# EAGLE design shield (EAGLE 7.0.0)
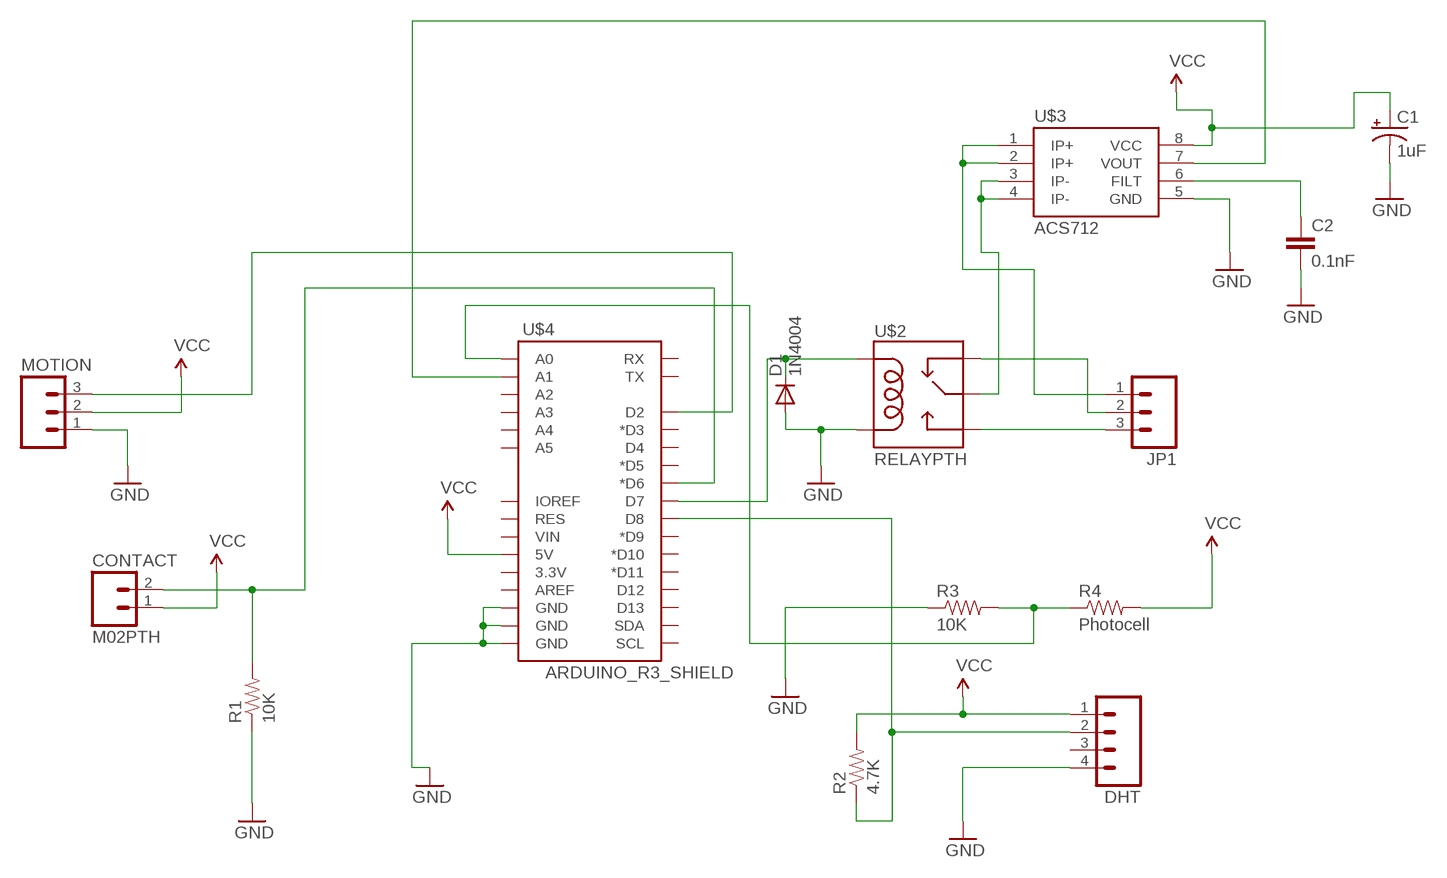
[diagram p0: schematic, sheet 1]

## Parts
C1  1uF  CAP_POLPTH2  [CPOL-RADIAL-10UF-25V]
C2  0.1nF  CAPPTH2  [CAP-PTH-SMALL2]
CONTACT  M02PTH  [1X02]
D1  1N4004  [DO41-10]
DHT  M04LOCK  [1X04_LOCK]
JP1  M03SCREW  [SCREWTERMINAL-3.5MM-3]
MOTION  M03PTH  [1X03]
R1  10K  RESISTORAXIAL-0.3  [AXIAL-0.3]
R2  4.7K  RESISTORAXIAL-0.3  [AXIAL-0.3]
R3  10K  RESISTORAXIAL-0.3  [AXIAL-0.3]
R4  Photocell  RESISTORAXIAL-0.3  [AXIAL-0.3]
U$2  RELAYPTH  [RELAY-G5Q]
U$3  ACS712  [SO08]
U$4  ARDUINO_R3_SHIELD  [UNO_R3_SHIELD]

## Nets
GND: C1.2(-) C2.2 D1.A DHT.4 MOTION.1 R1.P$1 R3.P$1 U$2.1(COIL2) U$3.5(GND) U$4.GND@0(GND) U$4.GND@1(GND) U$4.GND@2(GND)
N$1: R3.P$2 R4.P$1 U$4.A0
N$2: D1.C U$2.5(COIL1) U$4.D7
N$3: JP1.2 U$2.4(NC)
N$4: U$2.2(MAIN) U$3.3(IP-) U$3.4(IP-)
N$5: JP1.3 U$2.3(NO)
N$6: JP1.1 U$3.1(IP+) U$3.2(IP+)
N$7: C2.1 U$3.6(FILT)
N$8: MOTION.3 U$4.D2
N$9: DHT.2 R2.P$1 U$4.D8
N$10: CONTACT.2 R1.P$2 U$4.D6(*D6)
N$19: U$3.7(VOUT) U$4.A1
VCC: C1.1(+) CONTACT.1 DHT.1 MOTION.2 R2.P$2 R4.P$2 U$3.8(VCC) U$4.5V
Unconnected: DHT.3 U$4.3.3V U$4.A2 U$4.A3 U$4.A4 U$4.A5 U$4.AREF U$4.D3(*D3) U$4.D4 U$4.D5(*D5) U$4.D9(*D9) U$4.D10(*D10) U$4.D11(*D11) U$4.D12 U$4.D13 U$4.IOREF U$4.RES U$4.RX U$4.SCL U$4.SDA U$4.TX U$4.VIN

## Library data of the parts
C1 = SparkFun-Passives:CAP_POL: Capacitor Polarized These are standard SMD and PTH capacitors. Normally 10uF, 47uF, and 100uF in electrolytic and tantalum varieties. Always verify the external diameter of the through hole cap, it varies with capacity, voltage, and manufacturer. The EIA devices should be standard.
C2 = SparkFun-Passives:CAP: Capacitor Standard 0603 ceramic capacitor, and 0.1" leaded capacitor.
CONTACT = SparkFun-Connectors:M02: Standard 2-pin 0.1" header. Use with - straight break away headers ( PRT-00116) - right angle break away headers (PRT-00553) - swiss pins (PRT-00743) - machine pins (PRT-00117) - female headers (PRT-00115) Molex polarized connector foot print use with: PRT-08233 with associated crimp pins and housings. 2.54_SCREWTERM for use with PRT-10571. 3.5mm Screw Terminal footprints for PRT-08084 5mm Screw Terminal footprints for use with PRT-08433
D1 = adafruit:1N4004: DIODE General purpose 1N400x type rectifier (With bigger pads) http://www.ladyada.net/library/pcb/eaglelibrary.html
DHT = SparkFun-Connectors:M04: Header 4 Standard 4-pin 0.1" header. Use with straight break away headers (SKU : PRT-00116), right angle break away headers (PRT-00553), swiss pins (PRT-00743), machine pins (PRT-00117), and female headers (PRT-00115). Molex polarized connector foot print use with SKU : PRT-08231 with associated crimp pins and housings. 1MM SMD Version SKU: PRT-10208
JP1 MOTION = SparkFun-Connectors:M03: Header 3 Standard 3-pin 0.1" header. Use with straight break away headers (SKU : PRT-00116), right angle break away headers (PRT-00553), swiss pins (PRT-00743), machine pins (PRT-00117), and female headers (PRT-00115). Molex polarized connector foot print use with SKU : PRT-08232 with associated crimp pins and housings.
R1-R4 = SparkFun-Passives:RESISTOR: Resistor Basic schematic elements and footprints for 0603, 1206, and PTH resistors.
U$2 = SparkFun-Electromechanical:RELAY: SPDT relay (COM-00101)
U$3 = SparkFun-AnalogIC:ACS712: Hall-effect-based isolated linear current sensor
U$4 = SparkFun-Boards:ARDUINO_R3_SHIELD: Shield form compatible with the Arduino Uno R3.

## Board
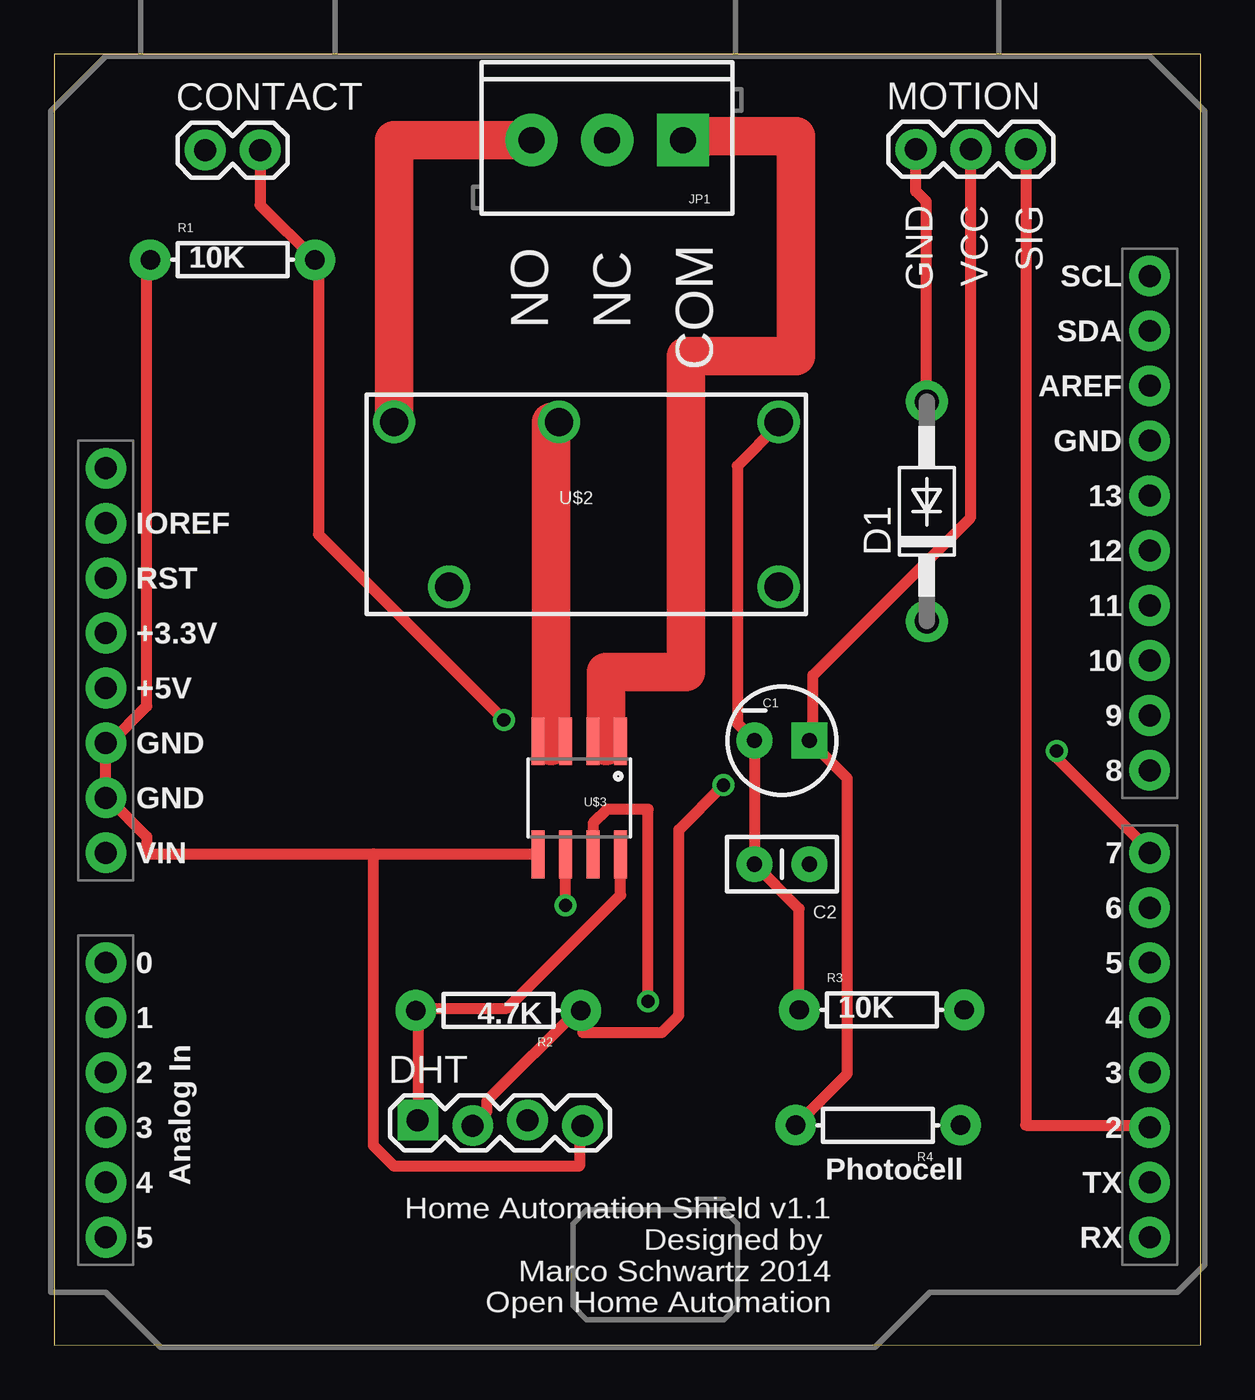
[diagram p1: board, top side]
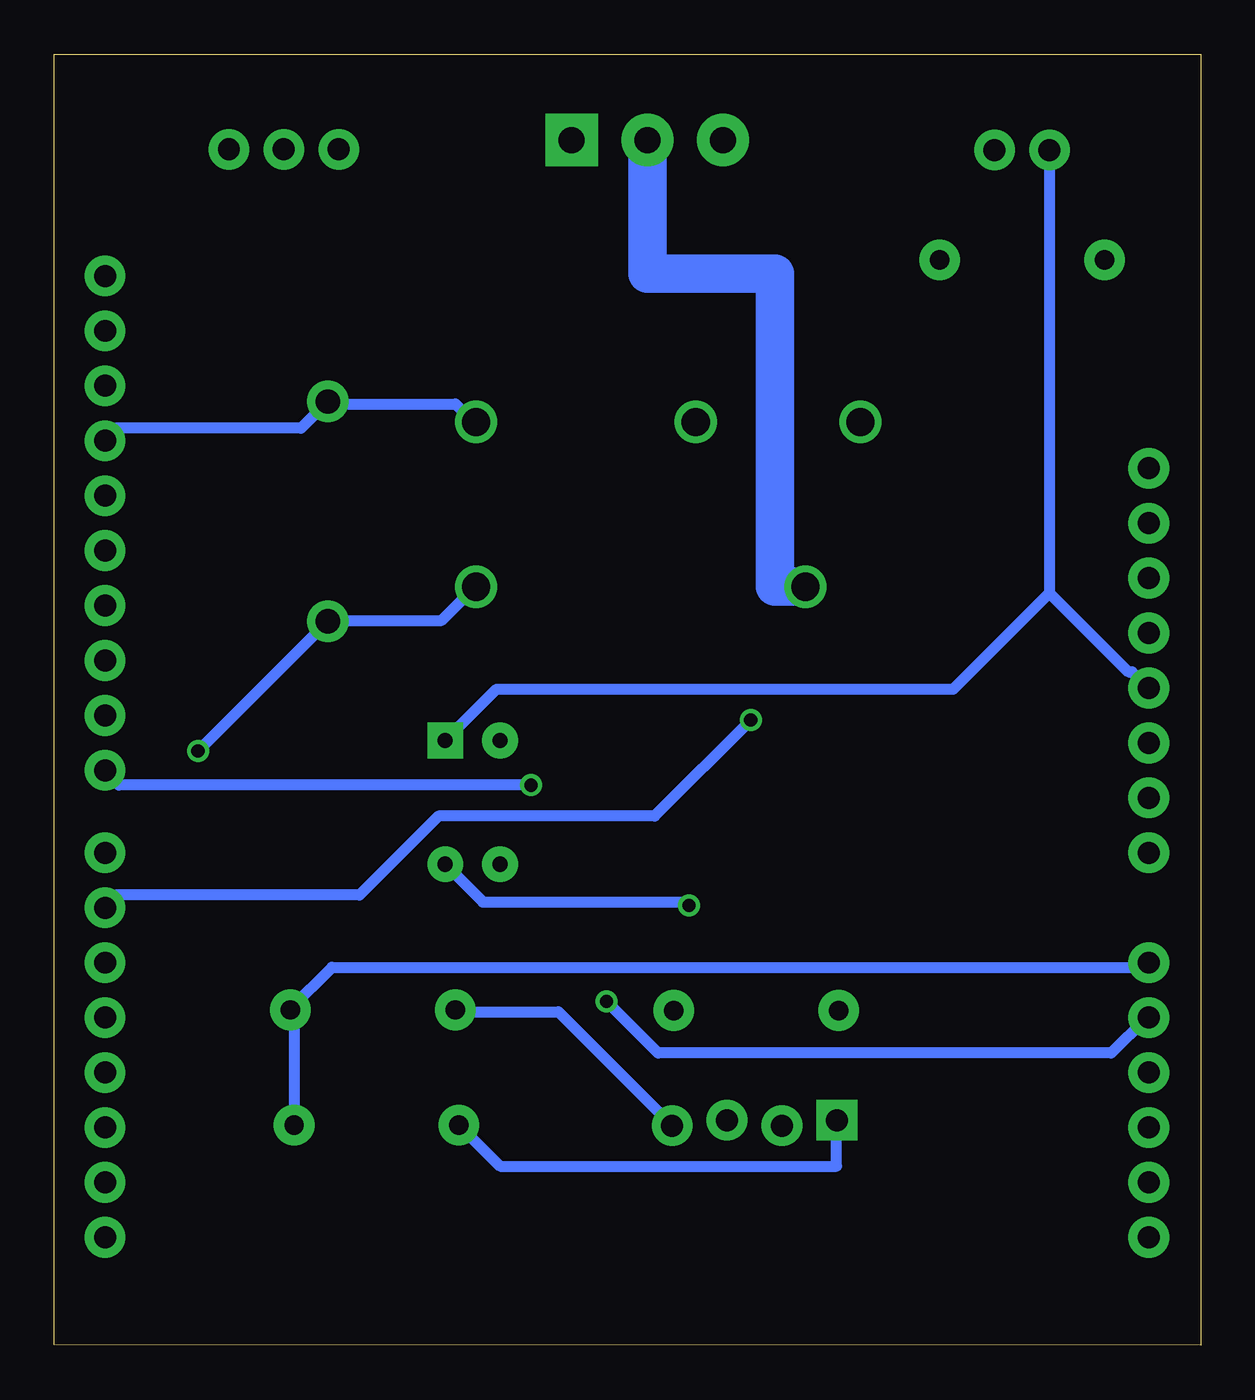
[diagram p2: board, bottom side, seen from below]

Size 53.01 x 59.71 mm. Coordinates in mm from the lower left corner, seen from the top.
Outline: 0,0 53.01,0.03 53.01,59.71 0,59.71 0,0
Copper layers (1*16): Top 0.035mm / dielectric 1.5mm / Bottom 0.035mm
Design rules "default *": minimum track width 20mil, minimum drill 24mil, track to track 26mil, track to pad 26mil, pad to pad 26mil, via to via 26mil, smd to smd 8mil, copper to edge 75mil, drill to drill 8mil, minimum pad ring 10mil, minimum via ring 8mil, stop-mask expansion 4mil, vias tented up to drill 0mil, thermal gap 10mil

### Footprints (pad centres in the part's own frame; a part is rotated, then mirrored left to right if it is on the bottom)
CPOL-RADIAL-10UF-25V = drill 0.7 pad 1.651 square: 1 1.27,0 | drill 0.7 pad 1.651: 2 -1.27,0
CAP-PTH-SMALL2 = drill 0.7 pad 1.651: 1 0,0; 2 2.54,0
1X02 = drill 1.016 pad 1.88: 1 0,0; 2 2.54,0
DO41-10 = drill 1.118 pad 1.93: A 5.08,0; C -5.08,0
1X04_LOCK = drill 1.016 pad 1.88 square: 1 0,0.127 | drill 1.016 pad 1.88: 2 2.54,-0.127; 3 5.08,0.127; 4 7.62,-0.127
SCREWTERMINAL-3.5MM-3 = drill 1.2 pad 2.413 square: 1 0,0 | drill 1.2 pad 2.413: 2 3.5,0; 3 7,0
1X03 = drill 1.016 pad 1.88: 1 0,0; 2 2.54,0; 3 5.08,0
AXIAL-0.3 = drill 0.9 pad 1.88: P$1 -3.81,0; P$2 3.81,0
RELAY-G5Q = drill 1.3: 1 8.89,3.81; 2 -1.27,3.81; 3 -8.89,3.81; 4 -6.35,-3.81; 5 8.89,-3.81
SO08 = smd 0.61 x 2.21: 1 -1.905,-2.616; 2 -0.635,-2.616; 3 0.635,-2.616; 4 1.905,-2.616; 5 1.905,2.616; 6 0.635,2.616; 7 -0.635,2.616; 8 -1.905,2.616
UNO_R3_SHIELD = drill 1.016 pad 1.88: 3.3V 50.8,26.67; 5V 50.8,29.21; A0 50.8,41.91; A1 50.8,44.45; A2 50.8,46.99; A3 50.8,49.53; A4 50.8,52.07; A5 50.8,54.61; AREF 2.54,15.24; D2 2.54,49.53; D3 2.54,46.99; D4 2.54,44.45; D5 2.54,41.91; D6 2.54,39.37; D7 2.54,36.83; D8 2.54,33.02; D9 2.54,30.48; D10 2.54,27.94; D11 2.54,25.4; D12 2.54,22.86; D13 2.54,20.32; GND@0 50.8,31.75; GND@1 50.8,34.29; GND@2 2.54,17.78; IOREF 50.8,21.59; NC 50.8,19.05; RES 50.8,24.13; RX 2.54,54.61; SCL 2.54,10.16; SDA 2.54,12.7; TX 2.54,52.07; VIN 50.8,36.83

### Placement (x,y rotation side)
C1  33.66,27.97 0 top
C2  34.92,22.25 180 top
CONTACT  6.98,55.27 0 top
D1  40.35,38.56 90 top
DHT  16.81,10.29 0 top
JP1  29.08,55.73 180 top
MOTION  39.85,55.3 0 top
R1  8.25,50.19 0 top
R2  20.54,15.49 180 top
R3  38.27,15.51 0 top
R4  38.1,10.19 180 top
U$2  24.61,38.89 0 top
U$3  24.28,25.32 180 top
U$4  53.19,59.61 180 top

### Tracks (layer width: path | path; a pad name or v marks a point on that pad's centre or on a via)
GND
  Top 0.508: 14.76,22.73 4.29,22.73 4.29,23.52 2.54,25.27 U$4.GND@1 2.38,25.58 2.38,27.81 U$4.GND@0 2.54,27.81 4.29,29.55 4.29,50.03 R1.P$1 | 14.76,22.73 22.23,22.73 U$3.5 | R3.P$1 34.45,15.58 34.45,20.19 C2.2 C1.2 31.59,28.76 31.59,40.67 33.5,42.57 U$2.1 | MOTION.1 39.85,53.37 40.32,52.89 40.32,43.68 D1.A | 14.76,22.73 14.76,9.23 15.72,8.28 24.29,8.28 24.29,10.03 DHT.4
  Bottom 0.508: DHT.4 24.45,10.19 29.69,15.42 34.45,15.42 R3.P$1 | U$4.GND@2 50.64,41.94 50.17,42.41 41.59,42.41 40.48,43.52 D1.A 40.16,43.52 34.45,43.52 33.66,42.73 U$2.1
N$1
  Bottom 0.508: U$4.A0 2.54,17.65 2.7,17.49 40.16,17.49 42.07,15.58 R3.P$2 41.91,15.42 R4.P$1
N$2  (via drill 0.61)
  Top 0.508: v46.36,27.49 46.36,27.17 50.64,22.89 U$4.D7
  Bottom 0.508: v46.36,27.49 40.48,33.36 D1.C 40.16,33.52 35.08,33.52 33.66,34.95 U$2.5
N$3
  Bottom 1.778: U$2.4 19.69,35.08 19.69,49.56 25.58,49.56 JP1.2
N$4
  Top 0.508: U$3.4 22.38,27.97 22.99,27.97 23.49,27.97 U$3.3
  Top 1.778: U$2.2 22.99,42.7 22.99,27.97 22.99,27.71
N$5
  Top 1.778: JP1.3 15.72,55.73 U$2.3
N$6
  Top 0.508: U$3.2 24.92,27.97 25.53,27.97 26.04,27.97 U$3.1
  Top 1.778: 25.53,27.71 25.53,27.97 25.53,31.14 29.21,31.14 29.21,45.75 34.29,45.75 34.29,55.91 29.08,55.91 JP1.1
N$7  (via drill 0.61)
  Top 0.508: v23.65,20.35 23.65,22.57 U$3.6
  Bottom 0.508: v23.65,20.35 23.81,20.5 33.18,20.5 C2.1
N$8
  Top 0.508: MOTION.3 44.93,10.19 50.64,10.19 U$4.D2
N$9  (via drill 0.61)
  Top 0.508: DHT.2 19.37,10.19 20,10.82 20,11.3 24.29,15.58 R2.P$1 24.45,15.27 24.45,14.47 28.1,14.47 28.89,15.27 28.89,23.84 v30.96,25.9
  Bottom 0.508: v30.96,25.9 50.01,25.9 50.64,26.54 U$4.D8
N$10  (via drill 0.61)
  Top 0.508: CONTACT.2 9.52,52.73 R1.P$2 12.22,50.03 12.22,37.49 v20.8,28.92
  Bottom 0.508: v20.8,28.92 25.24,24.47 35.24,24.47 38.89,20.82 50.17,20.82 50.64,20.35 U$4.D6
N$19  (via drill 0.61)
  Top 0.508: v27.46,15.9 27.46,24.79 25.56,24.79 24.92,24.16 24.92,22.73 U$3.7
  Bottom 0.508: v27.46,15.9 25.08,13.52 4.13,13.52 2.54,15.11 U$4.A1
VCC
  Top 0.508: U$3.8 26.19,22.57 26.19,20.82 20.95,15.58 16.83,15.58 R2.P$2 16.83,15.27 16.83,10.5 DHT.1 | R4.P$2 36.67,12.57 36.67,26.22 C1.1 35.08,28.12 35.08,30.98 42.39,38.28 MOTION.2
  Bottom 0.508: 6.98,34.79 3.33,31.14 3.18,31.14 2.54,30.51 U$4.5V | CONTACT.1 6.98,34.79 | R4.P$2 32.38,8.28 16.83,8.28 16.83,10.34 DHT.1 | 6.98,34.79 11.43,30.35 32.54,30.35 C1.1

### Text on the board
tPlace: GND | VCC | SIG | NO | NC | COM | Home Automation Shield v1.1 / Designed by / Marco Schwartz 2014 / Open Home Automation